# EAGLE schematic distortion-noise-and-ring-modulator-v1.1 (EAGLE 9.6.2)

## Sheet 1 of 3: Ring modulator
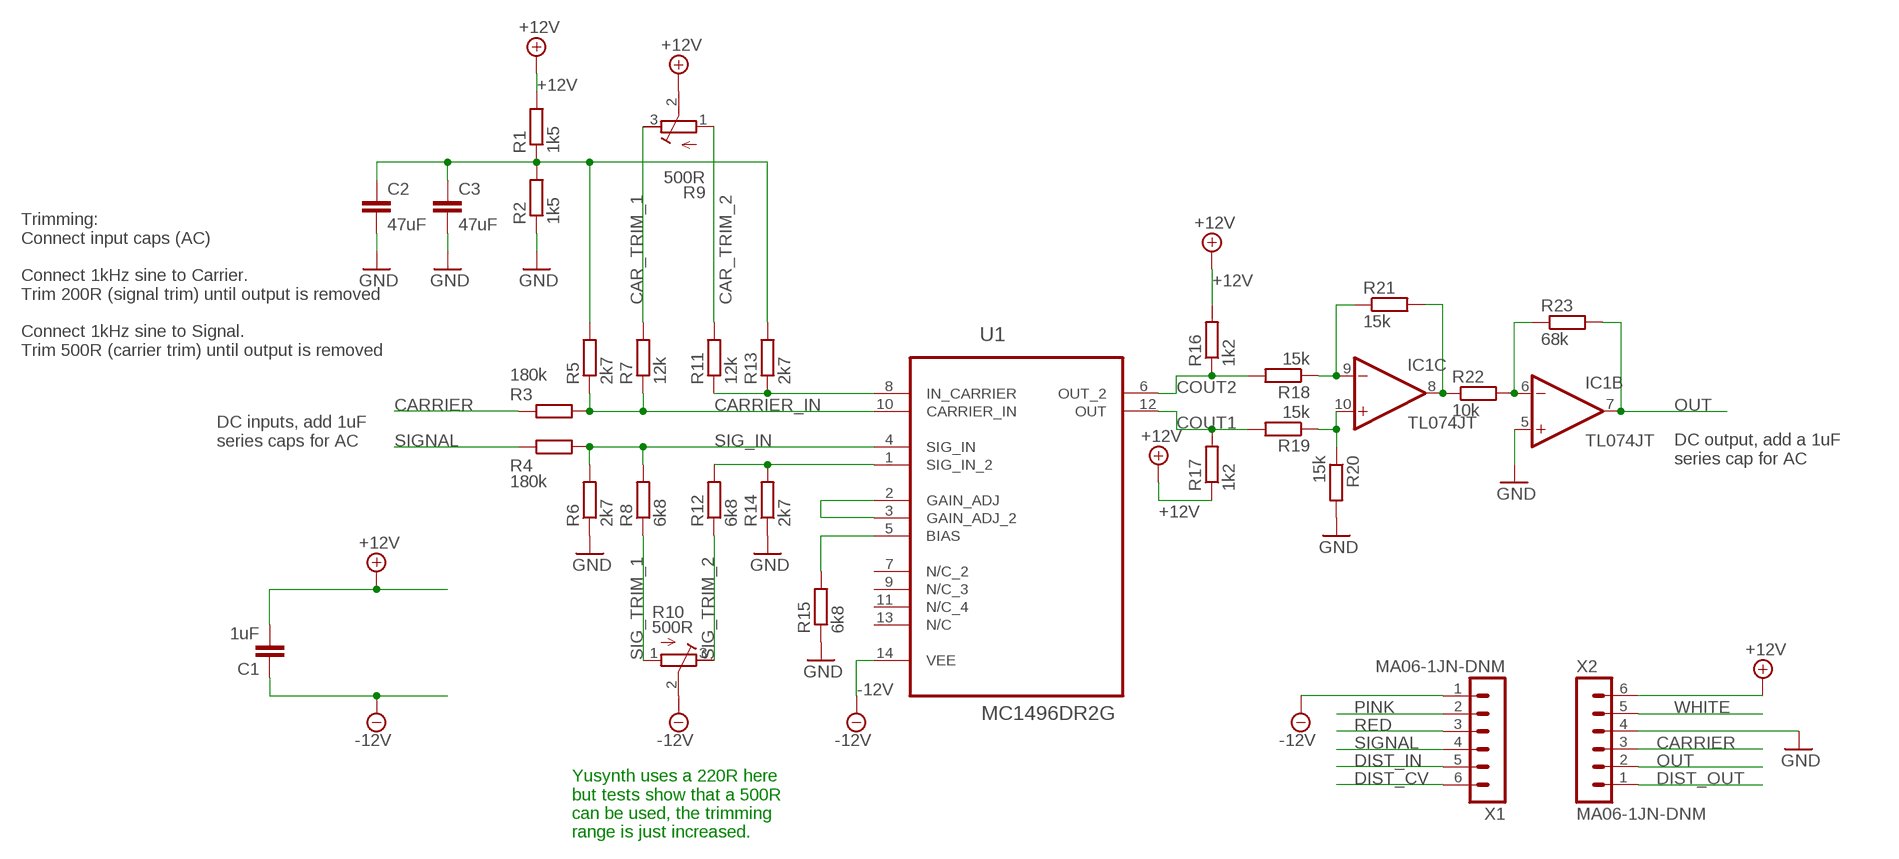
[diagram p0: schematic, sheet 1]

### Parts
C1  1uF  C-EU-J0402  [C0402-J]
C2  47uF  C-EUC1206  [C1206]
C3  47uF  C-EUC1206  [C1206]
IC1  TL074JT  [TSSOP14J]
R1  1k5  R-EU_R0402  [R0402]
R2  1k5  R-EU_R0402  [R0402]
R3  180k  R-EU_R0402  [R0402]
R4  180k  R-EU_R0402  [R0402]
R5  2k7  R-EU_R0603  [R0603]
R6  2k7  R-EU_R0603  [R0603]
R7  12k  R-EU_R0402  [R0402]
R8  6k8  R-EU_R0603  [R0603]
R9  500R  R-TRIMM3296X  [RTRIM3296X]
R10  500R  R-TRIMM3296X  [RTRIM3296X]
R11  12k  R-EU_R0402  [R0402]
R12  6k8  R-EU_R0603  [R0603]
R13  2k7  R-EU_R0603  [R0603]
R14  2k7  R-EU_R0603  [R0603]
R15  6k8  R-EU_R0603  [R0603]
R16  1k2  R-EU_R0603  [R0603]
R17  1k2  R-EU_R0603  [R0603]
R18  15k  R-EU_R0402  [R0402]
R19  15k  R-EU_R0402  [R0402]
R20  15k  R-EU_R0402  [R0402]
R21  15k  R-EU_R0402  [R0402]
R22  10k  R-EU_R0402  [R0402]
R23  68k  R-EU_R0603  [R0603]
U1  MC1496DR2G  [SOIC127P600X175-14N]
X1  MA06-1JN-DNM  MA06-1JN  [MA06N-1J]
X2  MA06-1JN-DNM  MA06-1JN  [MA06N-1J]

### Nets
+12V: C1.2 R1.2 R9.2(S) R16.2 R17.1 X2.6 ; also sheet 2,3
-12V: C1.1 R10.2(S) U1.14(VEE) X1.1 ; also sheet 2,3
CAR_TRIM_1: R7.2 R9.3(E)
CAR_TRIM_2: R9.1(A) R11.2
CARRIER: R3.1 X2.3
CARRIER_IN: R3.2 R5.1 R7.1 U1.10(CARRIER_IN)
COUT1: R17.2 R19.2 U1.12(OUT)
COUT2: R16.1 R18.2 U1.6(OUT_2)
DIST_CV: X1.6 ; also sheet 3
DIST_IN: X1.5 ; also sheet 3
DIST_OUT: X2.1 ; also sheet 3
GND: C2.2 C3.2 IC1.5(B:+IN) R2.1 R6.1 R14.1 R15.1 R20.2 X2.4 ; also sheet 2,3
N$3: R12.2 R14.2 U1.1(SIG_IN_2)
N$8: R11.1 R13.1 U1.8(IN_CARRIER)
N$9: C2.1 C3.1 R1.1 R2.2 R5.2 R13.2
N$11: R15.2 U1.5(BIAS)
N$12: U1.2(GAIN_ADJ) U1.3(GAIN_ADJ_2)
N$15: IC1.10(C:+IN) R19.1 R20.1
N$16: IC1.9(C:-IN) R18.1 R21.1
N$17: IC1.8(C:OUT) R21.2 R22.1
N$18: IC1.6(B:-IN) R22.2 R23.1
OUT: IC1.7(B:OUT) R23.2 X2.2
PINK: X1.2 ; also sheet 2
RED: X1.3 ; also sheet 2
SIG_IN: R4.2 R6.2 R8.2 U1.4(SIG_IN)
SIG_TRIM_1: R8.1 R10.1(A)
SIG_TRIM_2: R10.3(E) R12.1
SIGNAL: R4.1 X1.4
WHITE: X2.5 ; also sheet 2
Unconnected: U1.7(N/C_2) U1.9(N/C_3) U1.11(N/C_4) U1.13(N/C)

### Notes on the sheet
- Trimming:
  Connect input caps (AC)
  
  Connect 1kHz sine to Carrier. 
  Trim 200R (signal trim) until output is removed
  
  Connect 1kHz sine to Signal. 
  Trim 500R (carrier trim) until output is removed
- DC inputs, add 1uF 
  series caps for AC
- DC output, add a 1uF 
  series cap for AC
- Yusynth uses a 220R here
  but tests show that a 500R
  can be used, the trimming
  range is just increased.

## Sheet 2 of 3: Noise
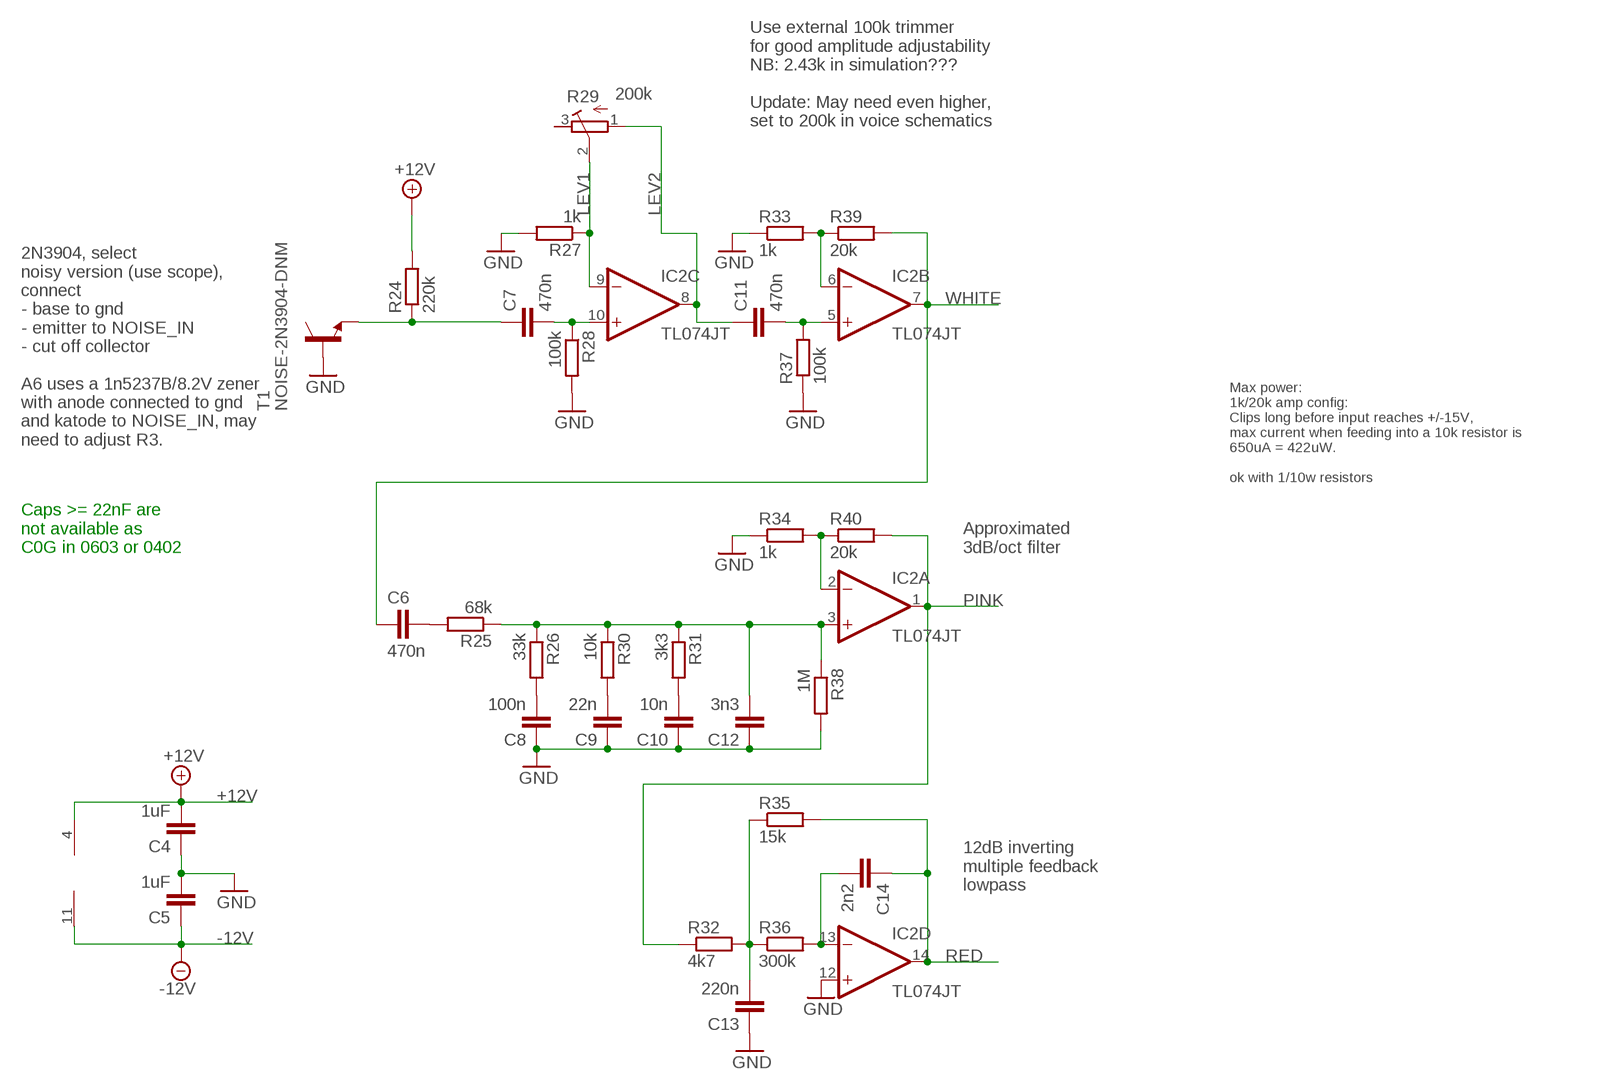
[diagram p1: schematic, sheet 2]

### Parts
C4  1uF  C-EU-J0402  [C0402-J]
C5  1uF  C-EU-J0402  [C0402-J]
C6  470n  C-EU-J0603  [C0603-J]
C7  470n  C-EU-J0603  [C0603-J]
C8  100n  C-EU-J0402  [C0402-J]
C9  22n  C-EU-J0402  [C0402-J]
C10  10n  C-EU-J0402  [C0402-J]
C11  470n  C-EU-J0603  [C0603-J]
C12  3n3  C-EU-J0603  [C0603-J]
C13  220n  C-EU-J0402  [C0402-J]
C14  2n2  C-EU-J0603  [C0603-J]
IC2  TL074JT  [TSSOP14J]
R24  220k  R-EU_R0603  [R0603]
R25  68k  R-EU_R0603  [R0603]
R26  33k  R-EU_R0402  [R0402]
R27  1k  R-EU_R0402  [R0402]
R28  100k  R-EU_R0402  [R0402]
R29  200k  R-TRIMM3296W  [RTRIM3296W]
R30  10k  R-EU_R0402  [R0402]
R31  3k3  R-EU_R0402  [R0402]
R32  4k7  R-EU_R0402  [R0402]
R33  1k  R-EU_R0402  [R0402]
R34  1k  R-EU_R0402  [R0402]
R35  15k  R-EU_R0402  [R0402]
R36  300k  R-EU_R0603  [R0603]
R37  100k  R-EU_R0402  [R0402]
R38  1M  R-EU_R0402  [R0402]
R39  20k  R-EU_R0402  [R0402]
R40  20k  R-EU_R0402  [R0402]
T1  NOISE-2N3904-DNM  NOISE-2N3904  [NOISE-2N3904-J]

### Nets
+12V: C4.2 IC2.4(P:V+) R24.2 ; also sheet 1,3
-12V: C5.1 IC2.11(P:V-) ; also sheet 1,3
GND: C4.1 C5.2 C8.1 C9.1 C10.1 C12.1 C13.1 IC2.12(D:+IN) R27.2 R28.2 R33.1 R34.1 R37.1 R38.2 T1.B ; also sheet 1,3
LEV1: IC2.9(C:-IN) R27.1 R29.2(S)
LEV2: C11.1 IC2.8(C:OUT) R29.1(A)
N$1: IC2.2(A:-IN) R34.2 R40.1
N$2: IC2.6(B:-IN) R33.2 R39.1
N$4: C8.2 R26.2
N$5: C9.2 R30.2
N$6: C10.2 R31.2
N$7: C7.1 R24.1 T1.E
N$10: C7.2 IC2.10(C:+IN) R28.1
N$13: C11.2 IC2.5(B:+IN) R37.2
N$14: C12.2 IC2.3(A:+IN) R25.1 R26.1 R30.1 R31.1 R38.1
N$19: C6.2 R25.2
N$20: C13.2 R32.2 R35.1 R36.1
N$21: C14.2 IC2.13(D:-IN) R36.2
PINK: IC2.1(A:OUT) R32.1 R40.2 ; also sheet 1
RED: C14.1 IC2.14(D:OUT) R35.2 ; also sheet 1
WHITE: C6.1 IC2.7(B:OUT) R39.2 ; also sheet 1
Unconnected: R29.3(E)

### Notes on the sheet
- Use external 100k trimmer 
  for good amplitude adjustability
  NB: 2.43k in simulation???
  
  Update: May need even higher, 
  set to 200k in voice schematics
- 2N3904, select
  noisy version (use scope),
  connect 
  - base to gnd
  - emitter to NOISE_IN
  - cut off collector
  
  A6 uses a 1n5237B/8.2V zener
  with anode connected to gnd 
  and katode to NOISE_IN, may
  need to adjust R3.
- Max power:
  1k/20k amp config:
  Clips long before input reaches +/-15V,
  max current when feeding into a 10k resistor is
  650uA = 422uW. 
  
  ok with 1/10w resistors
- Caps >= 22nF are
  not available as 
  C0G in 0603 or 0402
- Approximated
  3dB/oct filter
- 12dB inverting
  multiple feedback
  lowpass

## Sheet 3 of 3: Distortion
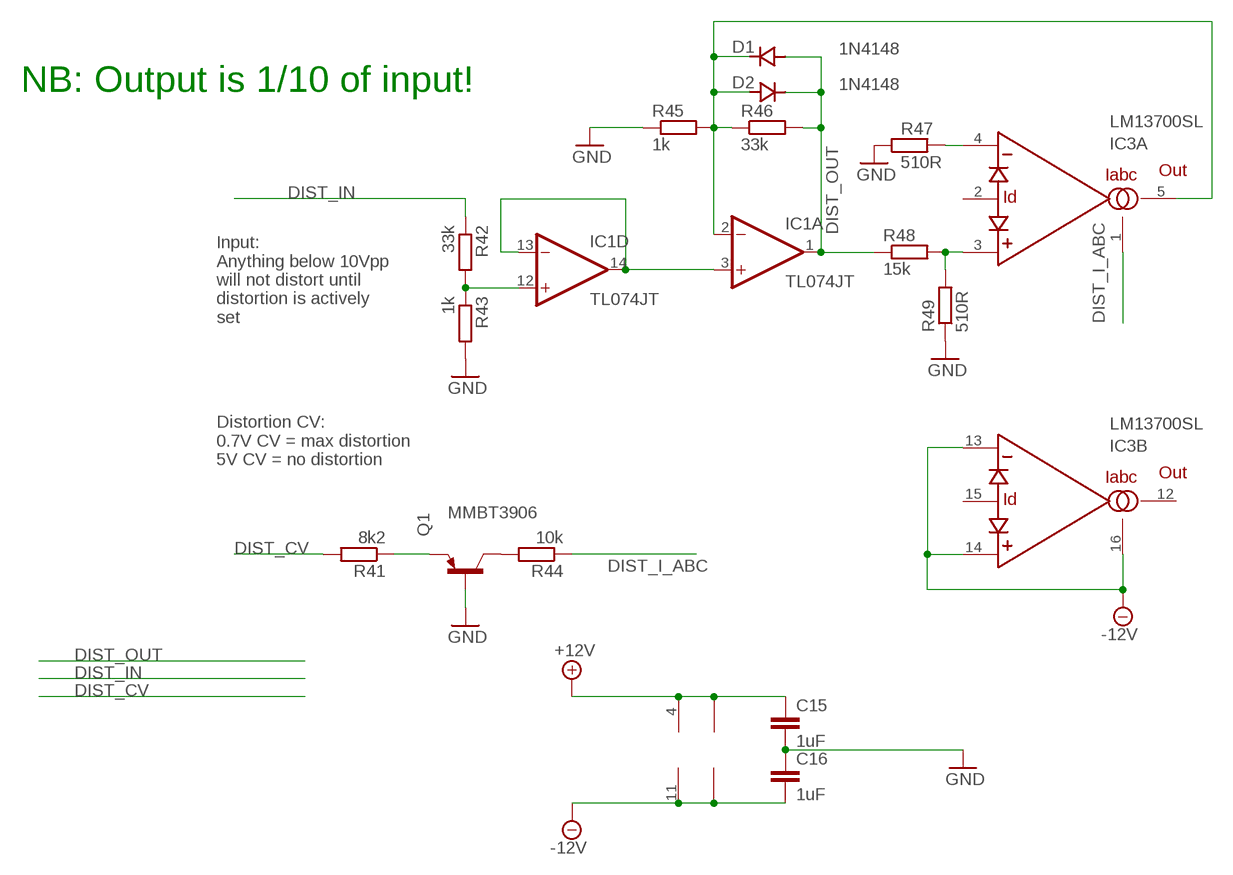
[diagram p2: schematic, sheet 3]

### Parts
C15  1uF  C-EU-J0402  [C0402-J]
C16  1uF  C-EU-J0402  [C0402-J]
D1  1N4148  1N4148SOD323  [SOD323J]
D2  1N4148  1N4148SOD323  [SOD323J]
IC3  LM13700SL  [SO16-NARROW-J]
Q1  MMBT3906  MMBT3906LT1SMD  [SOT23-BEC]
R41  8k2  R-EU_R0603  [R0603]
R42  33k  R-EU_R0402  [R0402]
R43  1k  R-EU_R0402  [R0402]
R44  10k  R-EU_R0402  [R0402]
R45  1k  R-EU_R0402  [R0402]
R46  33k  R-EU_R0402  [R0402]
R47  510R  R-EU_R0402  [R0402]
R48  15k  R-EU_R0402  [R0402]
R49  510R  R-EU_R0402  [R0402]

### Nets
+12V: C15.1 IC1.4(P:V+) IC3.11(V+) ; also sheet 1,2
-12V: C16.2 IC1.11(P:V-) IC3.6(V-) IC3.13(B:-IN) IC3.14(B:+IN) IC3.16(B:IABC) ; also sheet 1,2
DIST_CV: R41.2 ; also sheet 1
DIST_I_ABC: IC3.1(A:IABC) R44.1
DIST_IN: R42.1 ; also sheet 1
DIST_OUT: D1.2(A) D2.1(C) IC1.1(A:OUT) R46.2 R48.1 ; also sheet 1
GND: C15.2 C16.1 Q1.B R43.2 R45.1 R47.1 R49.1 ; also sheet 1,2
N$22: IC1.12(D:+IN) R42.2 R43.1
N$23: IC1.3(A:+IN) IC1.13(D:-IN) IC1.14(D:OUT)
N$24: D1.1(C) D2.2(A) IC1.2(A:-IN) IC3.5(A:OUT) R45.2 R46.1
N$25: IC3.4(A:-IN) R47.2
N$26: IC3.3(A:+IN) R48.2 R49.2
N$27: Q1.E R41.1
N$28: Q1.C R44.2
Unconnected: IC3.2(A:ID) IC3.7(IN) IC3.8(OUT) IC3.9(OUT) IC3.10(IN) IC3.12(B:OUT) IC3.15(B:ID)

### Notes on the sheet
- NB: Output is 1/10 of input!
- Input:
  Anything below 10Vpp
  will not distort until
  distortion is actively
  set
- Distortion CV:
  0.7V CV = max distortion
  5V CV = no distortion

## Library data of the parts
C1 C4-C16 = joakim:C-EU-J: CAPACITOR, European symbol
C2 C3 = rcl:C-EU: CAPACITOR, European symbol; SPICEPREFIX: C
D1 D2 = joakim:1N4148: DIODE high speed (Philips)
IC1 IC2 = joakim:TL074J: OP AMP
IC3 = joakim:LM13700: National Dual OTA with buffers.
Q1 = transistor-pnp:MMBT3906*: PNP Transistror
R1-R8 R11-R28 R30-R49 = rcl:R-EU_: RESISTOR, European symbol; SPICEPREFIX: R
R9 R10 R29 = rcl:R-TRIMM: Trimm resistor; SPICEMODEL: X; SPICEPREFIXL: POT
T1 = joakim:NOISE-2N3904: 2N3904 with the collector cut, used as a noise source
U1 = ON Semiconductor_By_element14_Batch_1:MC1496DR2G: Balanced Modulators/Demodulators; MPN: MC1496DR2G; OC_FARNELL: 1651904; OC_NEWARK: 45J1148; PACKAGE: SOIC-14; SUPPLIER: ON SEMICONDUCTOR
X1 X2 = joakim:MA06-1J